# Altium schematic sheet SHDN-CURRENT-S01-V00-CurrentBoard.SchDoc: Shutdown System, Current and 5kW Detection Board
size A3; DrawnBy: Jonn Dillon; DocumentNumber: 1; SheetNumber: 1; SheetTotal: 14; Project: Shutdown Current Board 2020
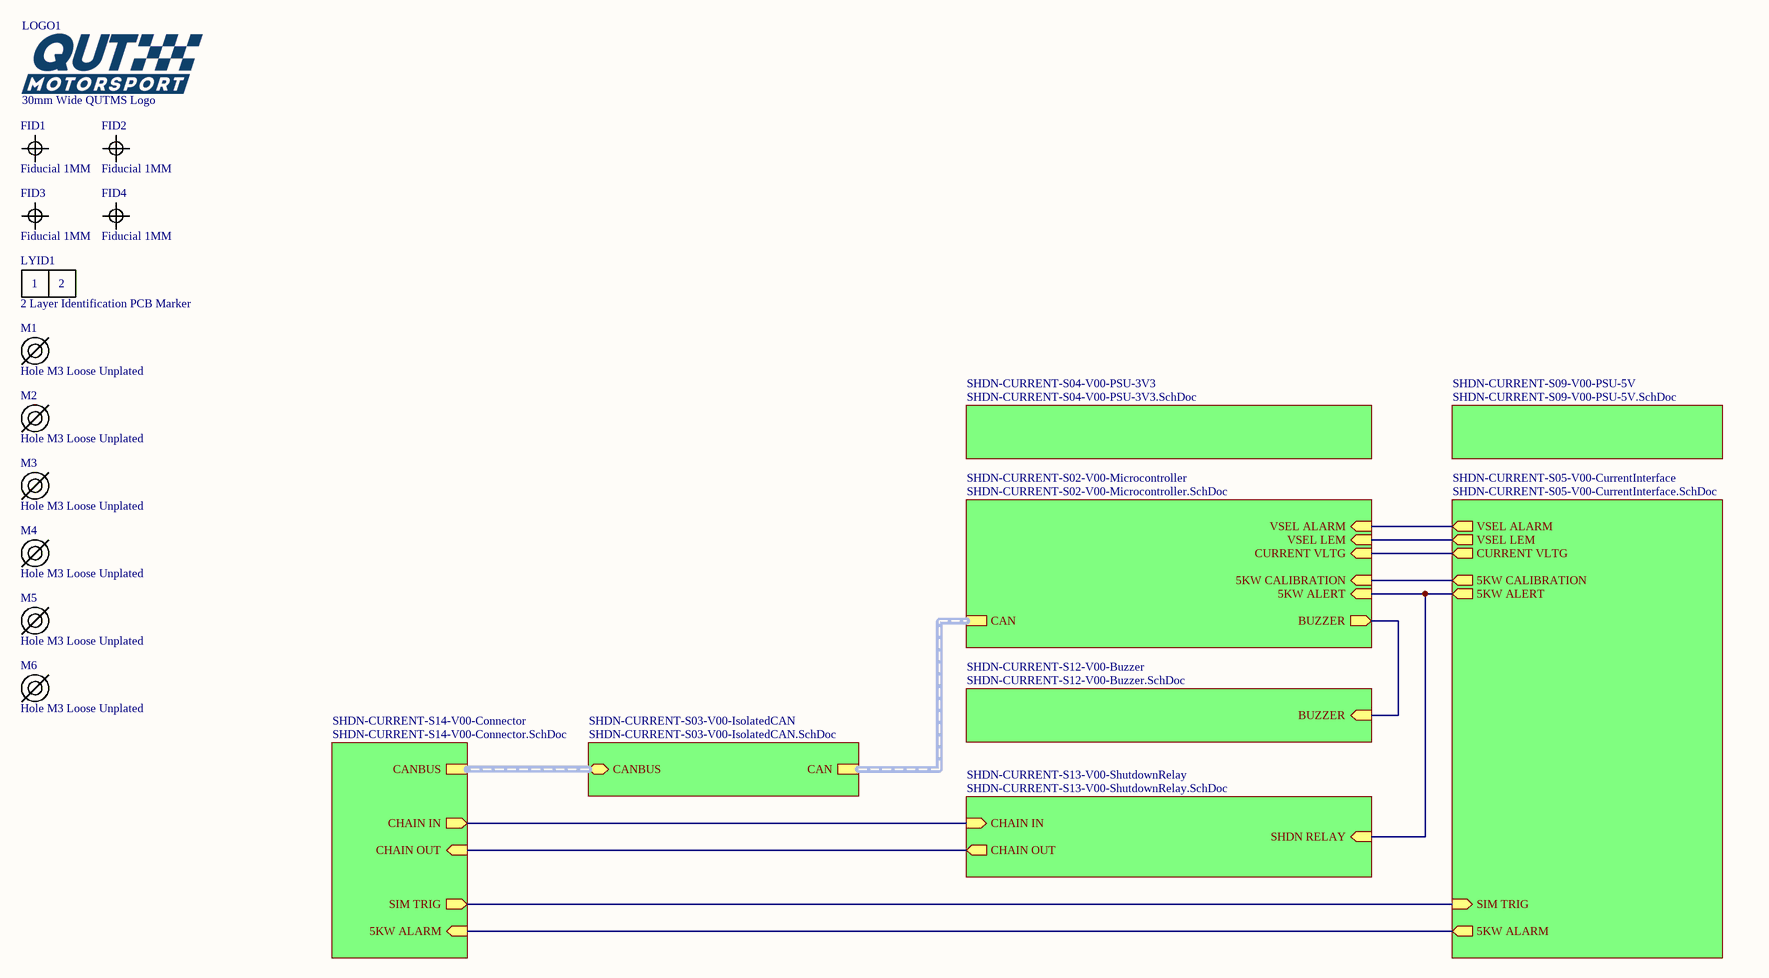
[diagram p0: SHDN-CURRENT-S01-V00-CurrentBoard.SchDoc]

## Parts
FID1  Fiducial 1MM  [FIDUCIAL 1MM]
FID2  Fiducial 1MM  [FIDUCIAL 1MM]
FID3  Fiducial 1MM  [FIDUCIAL 1MM]
FID4  Fiducial 1MM  [FIDUCIAL 1MM]
LOGO1  30mm Wide QUTMS Logo  [QUTMS LOGO 30MM]
LYID1  2 Layer Identification PCB Marker  [LAYER IDENT 2]
M1  Hole M3 Loose Unplated  [M3.5 UNPLATED]
M2  Hole M3 Loose Unplated  [M3.5 UNPLATED]
M3  Hole M3 Loose Unplated  [M3.5 UNPLATED]
M4  Hole M3 Loose Unplated  [M3.5 UNPLATED]
M5  Hole M3 Loose Unplated  [M3.5 UNPLATED]
M6  Hole M3 Loose Unplated  [M3.5 UNPLATED]

## Sub-sheets
SHDN-CURRENT-S02-V00-Microcontroller = SHDN-CURRENT-S02-V00-Microcontroller.SchDoc: 5KW CALIBRATION (in), 5KW ALERT (in), CURRENT VLTG (in), CAN (harness CAN), BUZZER (out), VSEL LEM (in), VSEL ALARM (in)
SHDN-CURRENT-S03-V00-IsolatedCAN = SHDN-CURRENT-S03-V00-IsolatedCAN.SchDoc: CANBUS (bidir, harness CANBUS), CAN (harness CAN)
SHDN-CURRENT-S04-V00-PSU-3V3 = SHDN-CURRENT-S04-V00-PSU-3V3.SchDoc: no entries
SHDN-CURRENT-S05-V00-CurrentInterface = SHDN-CURRENT-S05-V00-CurrentInterface.SchDoc: 5KW ALERT (out), 5KW CALIBRATION (out), CURRENT VLTG (out), SIM TRIG (in), VSEL ALARM (out), VSEL LEM (out), 5KW ALARM (out)
SHDN-CURRENT-S09-V00-PSU-5V = SHDN-CURRENT-S09-V00-PSU-5V.SchDoc: no entries
SHDN-CURRENT-S12-V00-Buzzer = SHDN-CURRENT-S12-V00-Buzzer.SchDoc: BUZZER (in)
SHDN-CURRENT-S13-V00-ShutdownRelay = SHDN-CURRENT-S13-V00-ShutdownRelay.SchDoc: SHDN RELAY (in), CHAIN OUT (out), CHAIN IN (in)
SHDN-CURRENT-S14-V00-Connector = SHDN-CURRENT-S14-V00-Connector.SchDoc: CHAIN OUT (in), CHAIN IN (out), CANBUS (harness CANBUS), SIM TRIG (out), 5KW ALARM (in)

## Nets
(unnamed): sheet SHDN-CURRENT-S05-V00-CurrentInterface/5KW ALERT, sheet SHDN-CURRENT-S02-V00-Microcontroller/5KW ALERT, sheet SHDN-CURRENT-S13-V00-ShutdownRelay/SHDN RELAY
(unnamed): sheet SHDN-CURRENT-S05-V00-CurrentInterface/5KW CALIBRATION, sheet SHDN-CURRENT-S02-V00-Microcontroller/5KW CALIBRATION
(unnamed): sheet SHDN-CURRENT-S05-V00-CurrentInterface/CURRENT VLTG, sheet SHDN-CURRENT-S02-V00-Microcontroller/CURRENT VLTG
(unnamed): sheet SHDN-CURRENT-S05-V00-CurrentInterface/SIM TRIG, sheet SHDN-CURRENT-S14-V00-Connector/SIM TRIG
(unnamed): sheet SHDN-CURRENT-S05-V00-CurrentInterface/VSEL ALARM, sheet SHDN-CURRENT-S02-V00-Microcontroller/VSEL ALARM
(unnamed): sheet SHDN-CURRENT-S05-V00-CurrentInterface/VSEL LEM, sheet SHDN-CURRENT-S02-V00-Microcontroller/VSEL LEM
(unnamed): sheet SHDN-CURRENT-S05-V00-CurrentInterface/5KW ALARM, sheet SHDN-CURRENT-S14-V00-Connector/5KW ALARM
(unnamed): sheet SHDN-CURRENT-S02-V00-Microcontroller/BUZZER, sheet SHDN-CURRENT-S12-V00-Buzzer/BUZZER
(unnamed): sheet SHDN-CURRENT-S13-V00-ShutdownRelay/CHAIN OUT, sheet SHDN-CURRENT-S14-V00-Connector/CHAIN OUT
(unnamed): sheet SHDN-CURRENT-S13-V00-ShutdownRelay/CHAIN IN, sheet SHDN-CURRENT-S14-V00-Connector/CHAIN IN

## Buses and harness runs
harness sheet SHDN-CURRENT-S02-V00-Microcontroller/CAN = sheet SHDN-CURRENT-S03-V00-IsolatedCAN/CAN
harness sheet SHDN-CURRENT-S03-V00-IsolatedCAN/CANBUS = sheet SHDN-CURRENT-S14-V00-Connector/CANBUS

## Notes on the sheet
- Revision History:
- Sheet Title:
- Rev
- Date
- Description
- Project:
- Size:
- Drawn By:
- A3
- Number:
- Revision:
- Sheet
- Version:
- of
- QUT Motorsport
- O-120, Gardens Point
- 2 George Street
- Brisbane, QLD 4000
- Australia
- Print Date:
- Print Time:
- File Name:
- (in symbol Layer Identification 2) 1; 2

## Library data of the parts
LOGO1 = QUTMS Logo 30mm
LYID1 = Layer Identification 2
M1-M6 = Hole M3 Loose Unplated: M3.5 Hole, No Plating